# EAGLE design avoccado-nora2-test-jig-panel-single (EAGLE 7.2.0)
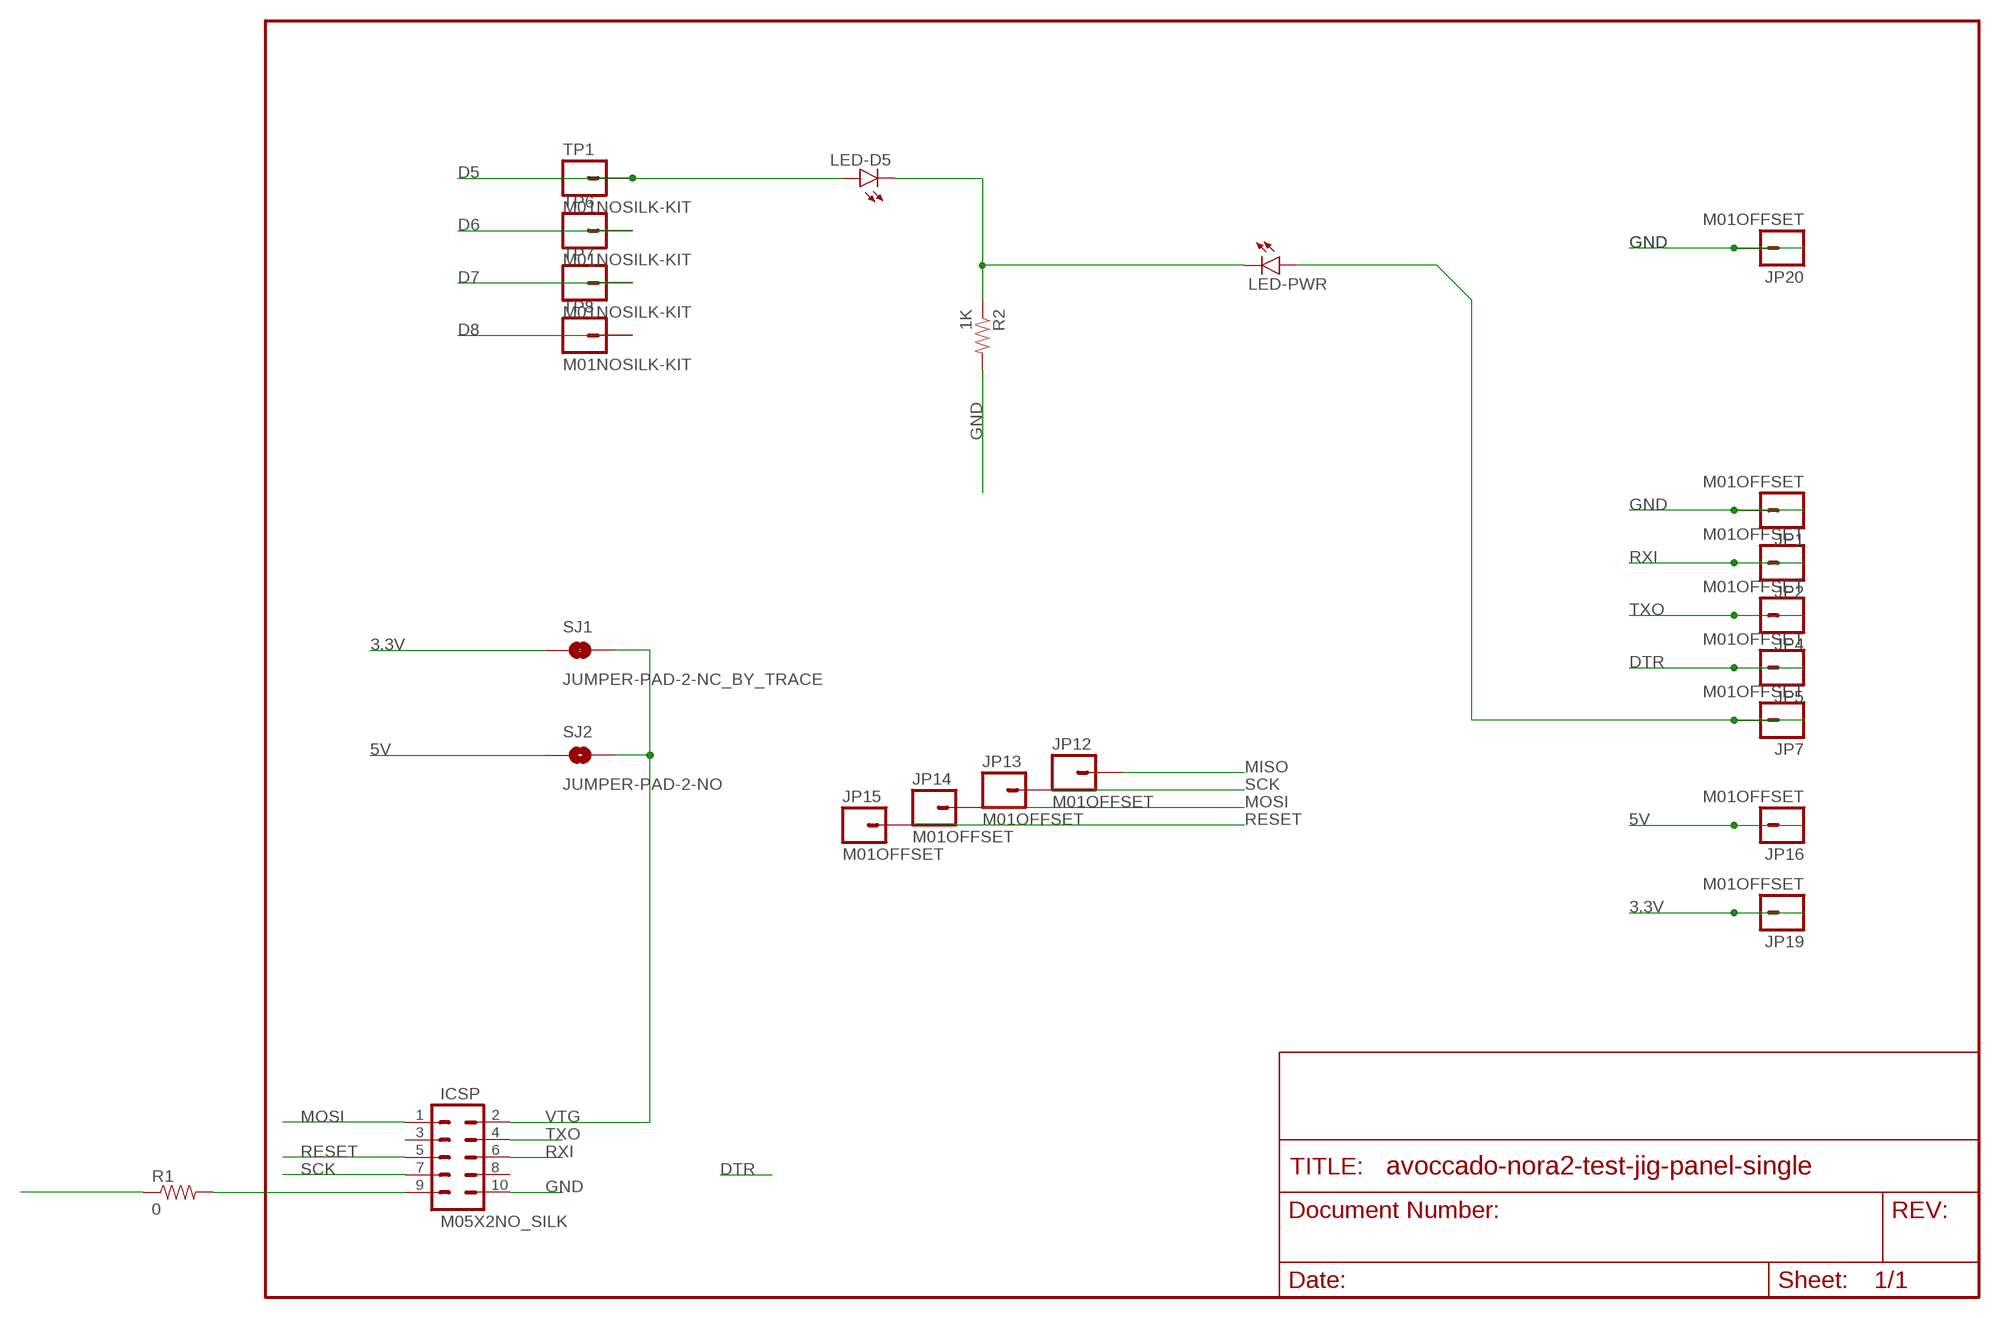
[diagram p0: schematic, sheet 1]

## Parts
ICSP  M05X2NO_SILK  [2X5_NOSILK]
JP1  M01OFFSET  [1X01_OFFSET]
JP2  M01OFFSET  [1X01_OFFSET]
JP4  M01OFFSET  [1X01_OFFSET]
JP5  M01OFFSET  [1X01_OFFSET]
JP7  M01OFFSET  [1X01_OFFSET]
JP12  M01OFFSET  [1X01_OFFSET]
JP13  M01OFFSET  [1X01_OFFSET]
JP14  M01OFFSET  [1X01_OFFSET]
JP15  M01OFFSET  [1X01_OFFSET]
JP16  M01OFFSET  [1X01_OFFSET]
JP19  M01OFFSET  [1X01_OFFSET]
JP20  M01OFFSET  [1X01_OFFSET]
LED-D5  LED0603  [LED-0603]
LED-PWR  LED0603  [LED-0603]
R1  0  RESISTOR1206  [1206]
R2  1K  RESISTOR0603  [0603-RES]
SJ1  JUMPER-PAD-2-NC_BY_TRACE  [PAD-JUMPER-2-NC_BY_TRACE_YES_SILK]
SJ2  JUMPER-PAD-2-NO  [PAD-JUMPER-2-NO_NO_SILK]
TP1  M01NOSILK-KIT  [1X01NS-KIT]
TP6  M01NOSILK-KIT  [1X01NS-KIT]
TP7  M01NOSILK-KIT  [1X01NS-KIT]
TP8  M01NOSILK-KIT  [1X01NS-KIT]

## Nets
3.3V: JP19.1 SJ1.1
5V: JP16.1 SJ2.1
D5: LED-D5.A TP1.1
D6: TP6.1
D7: TP7.1
D8: TP8.1
DTR: JP5.1
GND [vcc]: ICSP.10 JP1.1 JP20.1 R2.2
MISO: JP12.1 R1.1
MISO1: ICSP.9 R1.2
MOSI: ICSP.1 JP14.1
N$1: LED-D5.C LED-PWR.C R2.1
N$2: JP7.1 LED-PWR.A
RESET: ICSP.5 JP15.1
RXI: ICSP.6 JP2.1
SCK: ICSP.7 JP13.1
TXO: ICSP.4 JP4.1
VTG: ICSP.2 SJ1.2 SJ2.2
Unconnected: ICSP.3 ICSP.8

## Library data of the parts
ICSP = SparkFun-Connectors:M05X2: Header 5x2 Standard 10-pin dual row 0.1" header. Commonly used with AVR-ISP. Use with Spark Fun Electronics SKU: PRT-00778
JP1 JP2 JP4 JP5 JP7 JP12-JP16 JP19 JP20 TP1 TP6-TP8 = SparkFun-Connectors:M01: Header 1 Standard 1-pin 0.1" header. Use with straight break away headers (SKU : PRT-00116), right angle break away headers (PRT-00553), swiss pins (PRT-00743), machine pins (PRT-00117), and female headers (PRT-00115).
LED-D5 LED-PWR = SparkFun-LED:LED: LEDs Standard schematic elements and footprints for 5mm, 3mm, 1206, and 0603 sized LEDs. 5mm - Spark Fun Electronics SKU : COM-00529 (and others)
R1 = SparkFun-Passives:RESISTOR: Resistor Basic schematic elements and footprints for 0603, 1206, and PTH resistors.
R2 = SparkFun-Resistors:RESISTOR: Resistor Basic schematic elements and footprints for 0603, 1206, and PTH resistors.
SJ1 = SparkFun-Passives:JUMPER-PAD-2-NC_BY_TRACE
SJ2 = SparkFun-Passives:JUMPER-PAD-2-NO

## Net classes
1 vcc: width 0.254 mm
3 usbvcc: width 0.203 mm, drill 0.61 mm, clearance 0.152 mm

## Board
Avoccado-avr-yolandi Yolandi is the minified version of Avoccado-avr with less pins broken out and a footprint of less than one square inch for the PCB without peripherals.
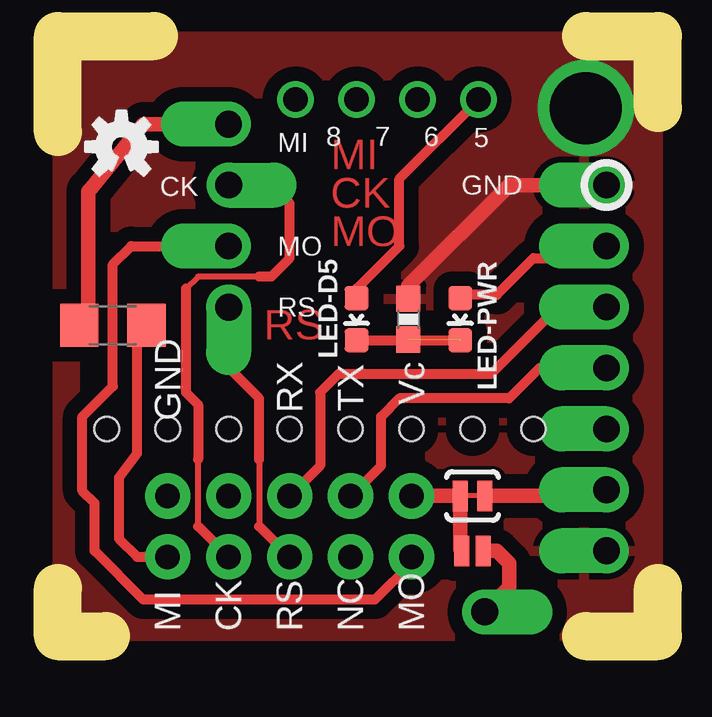
[diagram p1: board, top side]
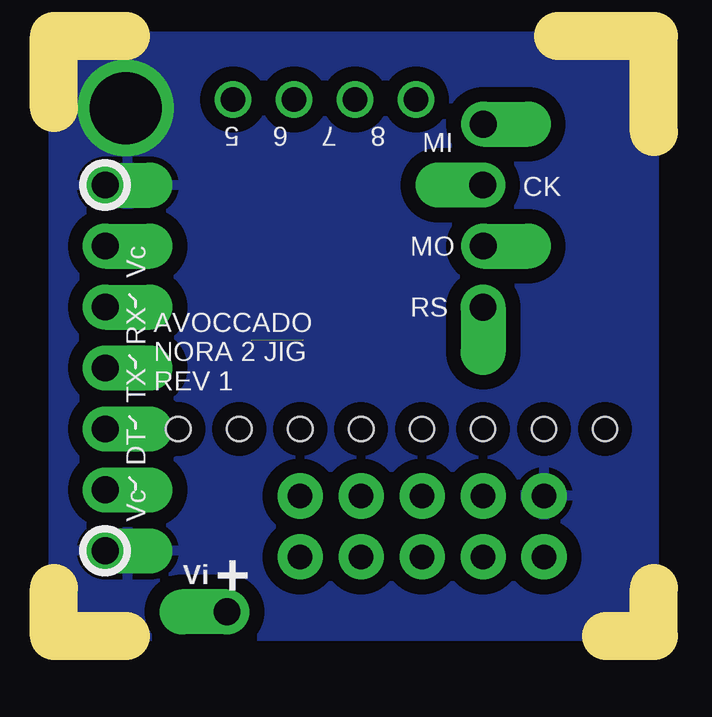
[diagram p2: board, bottom side, seen from below]

No outline drawn. Coordinates in mm, seen from the top.
Copper layers (1*16): Top 0.035mm / dielectric 1.5mm / Bottom 0.035mm
Design rules "dirt_cheap_dirty_boards.v1 *": minimum track width 5mil, minimum drill 12mil, track to track 5mil, track to pad 5mil, pad to pad 5mil, via to via 5mil, smd to smd 0mil, copper to edge 10mil, drill to drill 10mil, minimum pad ring 10mil, minimum via ring 6mil, stop-mask expansion 0mil, vias tented up to drill 25mil, thermal gap 10mil
Holes 1.02 mm at 4.57,8.64 7.11,8.64 9.65,8.64 12.19,8.64 14.73,8.64 17.27,8.64 19.81,8.64 2.03,8.64
tRestrict: area 3,3 to 14.7,7.1; area 7.1,9.1 to 12.7,21.3; area 12.7,19.8 to 14.7,21.3; area 1.5,3.6 to 5.1,15.7
Milling: 8 lines

### Footprints (pad centres in the part's own frame; a part is rotated, then mirrored left to right if it is on the bottom)
2X5_NOSILK = drill 1.016 pad 1.88: 1 -1.27,5.08; 2 1.27,5.08; 3 -1.27,2.54; 4 1.27,2.54; 5 -1.27,0; 6 1.27,0; 7 -1.27,-2.54; 8 1.27,-2.54; 9 -1.27,-5.08; 10 1.27,-5.08
1X01_OFFSET = drill 1.118 pad 1.88 offset: 1 0,0
LED-0603 = smd 1 x 1: A 0,-0.877; C 0,0.877
1206 = smd 1.6 x 1.8: 1 -1.4,0; 2 1.4,0
0603-RES = smd 1.1 x 1: 1 -0.85,0; 2 0.85,0
PAD-JUMPER-2-NC_BY_TRACE_YES_SILK = smd 0.635 x 1.27: 1 -0.508,0; 2 0.508,0
PAD-JUMPER-2-NO_NO_SILK = smd 0.635 x 1.27: 1 -0.45,0; 2 0.45,0
1X01NS-KIT = drill 1.016 pad 1.524: 1 0,0

### Placement (x,y rotation side)
ICSP  9.65,4.57 90 bottom
JP1  22.86,3.56 90 top
JP2  22.86,13.72 90 top
JP4  22.86,11.18 90 top
JP5  22.86,8.64 90 top
JP7  22.86,16.26 90 top
JP12  7.1,21.34 90 top
JP13  7.12,18.8 270 top
JP14  7.1,16.26 90 top
JP15  7.11,13.71 180 top
JP16  17.78,1.02 270 top
JP19  22.86,6.1 90 top
JP20  22.86,18.8 90 top
LED-D5  12.45,13.21 180 top
LED-PWR  16.76,13.21 180 top
LOGO2  OSHW-LOGOS  [OSHW-LOGO-S]  2.65,20.39 0 top
R1  2.29,12.95 0 top
R2  14.61,13.21 90 top
SJ1  17.27,5.84 180 top
SJ2  17.27,3.56 180 top
TP1  17.53,22.36 270 top
TP6  14.99,22.36 270 top
TP7  12.45,22.36 270 top
TP8  9.91,22.36 270 top

### Tracks (layer width: path | path; a pad name or v marks a point on that pad's centre or on a via)
3.3V
  Top 0.406: 22.6,5.84 22.61,5.84 JP19.1
  Top 0.61: SJ1.1 22.6,5.84
5V
  Top 0.406: 18.28,1.52 JP16.1
  Top 0.61: SJ2.1 18.29,3.56 18.8,3.05 18.8,2.03 18.29,1.52 18.28,1.52
D5
  Top 0.406: TP1.1 14.22,19.06 14.22,16.26 12.45,14.48 LED-D5.A
GND  (via drill 3 pad 4)
  Top 0.406: JP20.1
  Top 0.61: R2.2 14.61,14.61 18.8,18.8 JP20.1
  other vias: 22,22
  pour Bottom (isolate 0.61): 0.4,23.02 21,23 22.5,21.5 22.5,1 0.4,1
  pour Top (isolate 0.61): 0,0 0,25 25,25 25,0
  pour Bottom (isolate 0.61): 25,0 25,25 0,25 0,0
MISO
  Top 0.61: JP12.1 3.56,21.34 1.39,18.67 1.27,18.54 1.27,13.72 0.89,13.33 R1.1
MISO1
  Top 0.406: ICSP.9 3.3,3.3 2.54,4.06 2.54,6.6 3.3,7.62 3.3,12.45 R1.2
MOSI
  Top 0.406: ICSP.1 14.73,3.05 13.21,1.52 3.56,1.52 1.52,3.56 1.52,5.54 1.02,6.05 1.02,9.14 2.29,10.41 2.29,15.49 3.05,16.26 JP14.1
N$1  (1 unrouted)
  Top 0.406: LED-D5.C LED-PWR.C
N$2
  Top 0.406: JP7.1 22.35,15.75 19.81,15.75 18.29,14.22 16.9,14.22 LED-PWR.A
RESET
  Top 0.254: 8.38,7.37 8.38,4.57
  Top 0.305: JP15.1
  Top 0.406: 8.38,4.57 ICSP.5 | 8.38,7.37 8.38,9.91 7.11,11.18 JP15.1
RXI
  Top 0.406: JP2.1 20.83,13.72 18.03,10.92 11.68,10.92 10.92,10.16 10.92,7.11 ICSP.6
SCK
  Top 0.254: 5.84,4.57 5.84,7.37 | 8.38,14.99 5.84,14.99 5.33,14.48
  Top 0.406: 5.84,4.57 ICSP.7 | JP13.1 8.89,18.8 9.65,18.03 9.65,15.75 8.89,14.99 8.38,14.99 | 5.33,14.48 5.33,10.16 5.84,9.65 5.84,7.37
TXO
  Top 0.406: ICSP.4 13.46,7.11 13.46,9.14 14.22,9.91 18.8,9.91 20.07,11.18 JP4.1
VTG
  Top 0.61: SJ2.2 16.76,3.61 SJ1.2 ICSP.2

### Text on the board
Top: MI | CK | MO | RS
tPlace: MI | 8 | 7 | 6 | 5 | CK | GND | MO | RS | GND | RX | TX | Vc | MI | CK | RS | NC | MO
bPlace: MI | 8 | 7 | 6 | 5 | CK | MO | Vc | RS | RX | AVOCCADO / NORA 2 JIG / REV 1 | TX | DT | Vc | + | Vi